# Altium schematic sheet [4] Temperature_Sensor.SchDoc
size A4; Organization: Altium Limited; Address1: L3, 12a Rodborough Rd; Address2: Frenchs Forest; Address3: NSW; Address4: Australia 2086
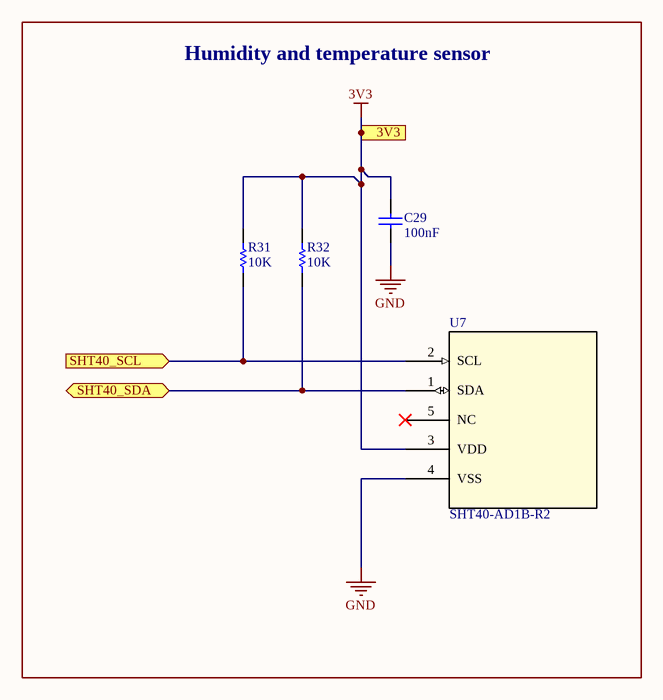
[diagram p0: [4] Temperature_Sensor.SchDoc]

## Parts
C29  100nF  [Capacitor 0402]
R31  10K  [Resistencia 0402]
R32  10K  [Resistencia 0402]
U7  SHT40-AD1B-R2  [SHT4x_SEN]

## Blocks framed on the sheet
Humidity and temperature sensor: C29 R31 R32 U7

## Ports
3V3, SHT40_SCL (in), SHT40_SDA (bidir)

## Nets
3V3: C29.2 R31.2(B) R32.2(B) U7.3(VDD) ; port 3V3
GND: C29.1 U7.4(VSS)
SHT40_SCL: R31.1(A) U7.2(SCL) ; port SHT40_SCL
SHT40_SDA: R32.1(A) U7.1(SDA) ; port SHT40_SDA

Not connected (* = marked no-connect by the designer): U7 5(NC)*

## Notes on the sheet
- Title
- Size:
- Date:
- A4
- Number:
- Time:
- Revision:
- Sheet
- of
- File:

## Library data of the parts
C29 = Capacitor 0402: Capacitor Ceramico SMD 0402
R31 R32 = Resistencia SMD 0402
U7 = SHT40-AD1B-R2: Humidity, Temperature 0 ~ 100% RH I2C ±1.8% RH Surface Mount; Manufacturer_Name: Sensirion; Copyright: Copyright (C) 2026 Ultra Librarian. All rights reserved.; Manufacturer_Part_Number: SHT40-AD1B-R2; RefDes: RefDes; Type: Type